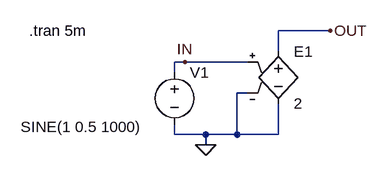
[diagram p0: schematic Fig_2-71_E-source.asc]
Fig_2-71_E-source.asc, the LTspice schematic file:
Version 4
SHEET 1 880 680
WIRE 368 112 288 112
WIRE 288 144 288 112
WIRE 144 160 128 160
WIRE 240 160 144 160
WIRE 128 176 128 160
WIRE 240 208 224 208
WIRE 128 272 128 256
WIRE 176 272 128 272
WIRE 224 272 224 208
WIRE 224 272 176 272
WIRE 288 272 288 224
WIRE 288 272 224 272
WIRE 176 288 176 272
FLAG 176 288 0
FLAG 368 112 OUT
FLAG 144 160 IN
SYMBOL e 288 128 R0
SYMATTR InstName E1
SYMATTR Value 2
SYMBOL voltage 128 160 R0
WINDOW 3 -237 100 Left 2
WINDOW 123 0 0 Left 0
WINDOW 39 0 0 Left 0
SYMATTR InstName V1
SYMATTR Value SINE(1 0.5 1000)
TEXT -96 112 Left 2 !.tran 5m

The netlist it stands for:
* Fig_2-71_E-source.asc
E1 OUT 0 IN 0 2
V1 IN 0 SINE(1 0.5 1000)
.tran 5m
.backanno
.end